# EAGLE design FastFoto (EAGLE 6.5.0)
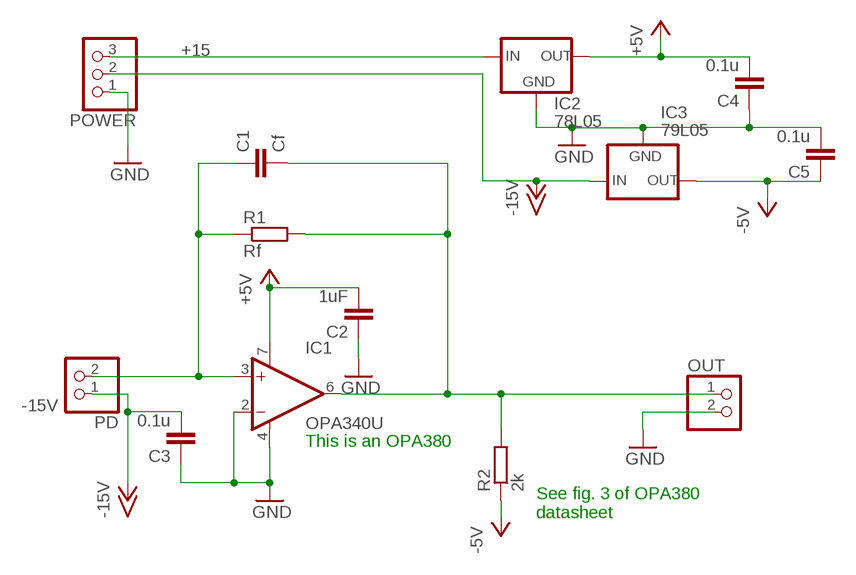
[diagram p0: schematic, sheet 1]

## Parts
C1  Cf  C-EU050-030X075  [C050-030X075]
C2  1uF  C-EU050-030X075  [C050-030X075]
C3  0.1u  C-EU050-030X075  [C050-030X075]
C4  0.1u  C-EU050-030X075  [C050-030X075]
C5  0.1u  C-EU050-030X075  [C050-030X075]
IC1  OPA340U  [SO08]
IC2  78L05  78LXX  [78LXX]
IC3  79L05  79LXX  [79LXX]
OUT  PINHD-1X2  [1X02]
PD  PINHD-1X2  [1X02]
POWER  PINHD-1X3  [1X03]
R1  Rf  R-EU_0204/7  [0204/7]
R2  2k  R-EU_0204/7  [0204/7]

## Nets
+5V: C2.2 C4.2 IC1.7(V+) IC2.OUT
+15: IC2.IN POWER.3
-5V: C5.1 IC3.OUT R2.1
-15V: C3.2 IC3.IN PD.1 POWER.2
GND: C2.1 C3.1 C4.1 C5.2 IC1.2(-IN) IC1.4(V-) IC2.GND IC3.GND OUT.2 POWER.1
N$1: C1.2 IC1.6(OUT) OUT.1 R1.2 R2.2
N$2: C1.1 IC1.3(+IN) PD.2 R1.1

## Notes on the sheet
- This is an OPA380
- See fig. 3 of OPA380
  datasheet

## Library data of the parts
C1-C5 = rcl:C-EU: CAPACITOR, European symbol
IC1 = burr-brown:OPA340: Rail-to-Rail Operational Amplifiers Single-Supply, MicroAmplifier(TM) Series; MPN: OPA340UA; OC_FARNELL: 1106196; OC_NEWARK: 24M5449
IC2 = v-reg:78LXX: VOLTAGE REGULATOR
IC3 = v-reg:79LXX: VOLTAGE REGULATOR
OUT PD = pinhead:PINHD-1X2: PIN HEADER
POWER = pinhead:PINHD-1X3: PIN HEADER
R1 R2 = rcl:R-EU_: RESISTOR, European symbol

## Board
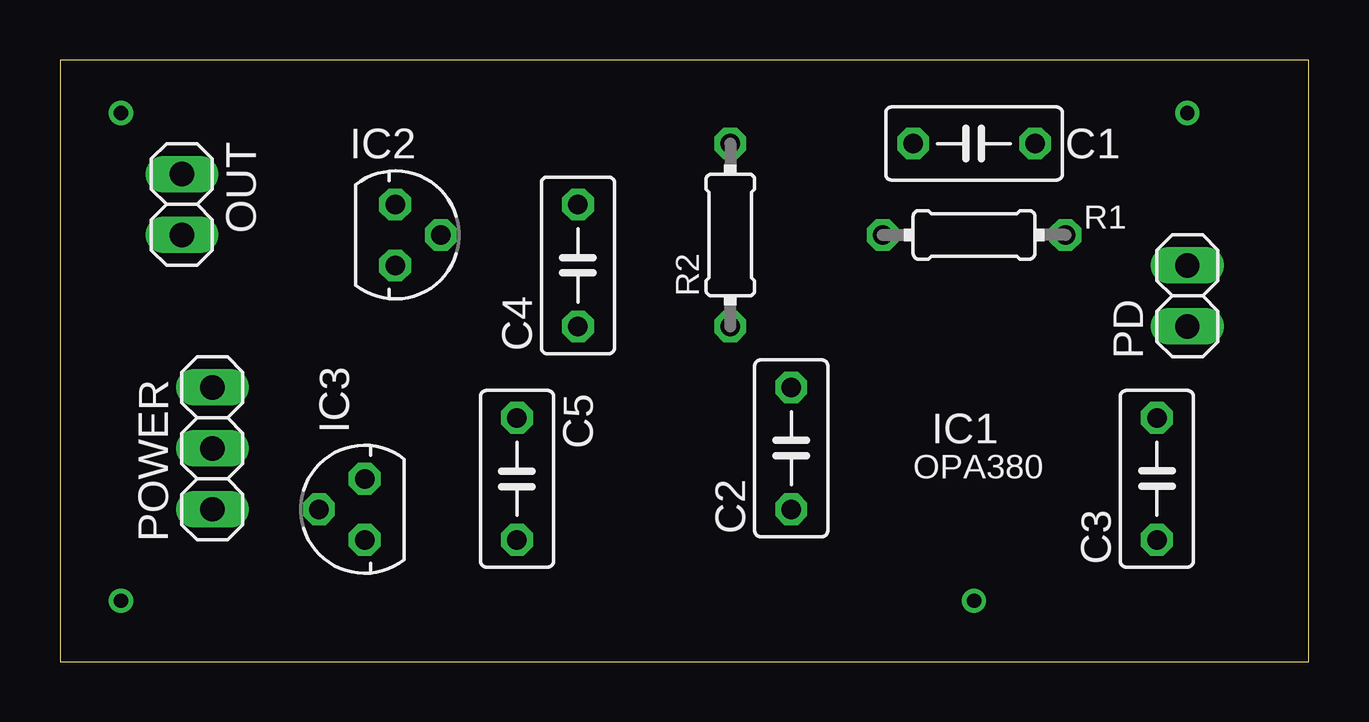
[diagram p1: board, top side]
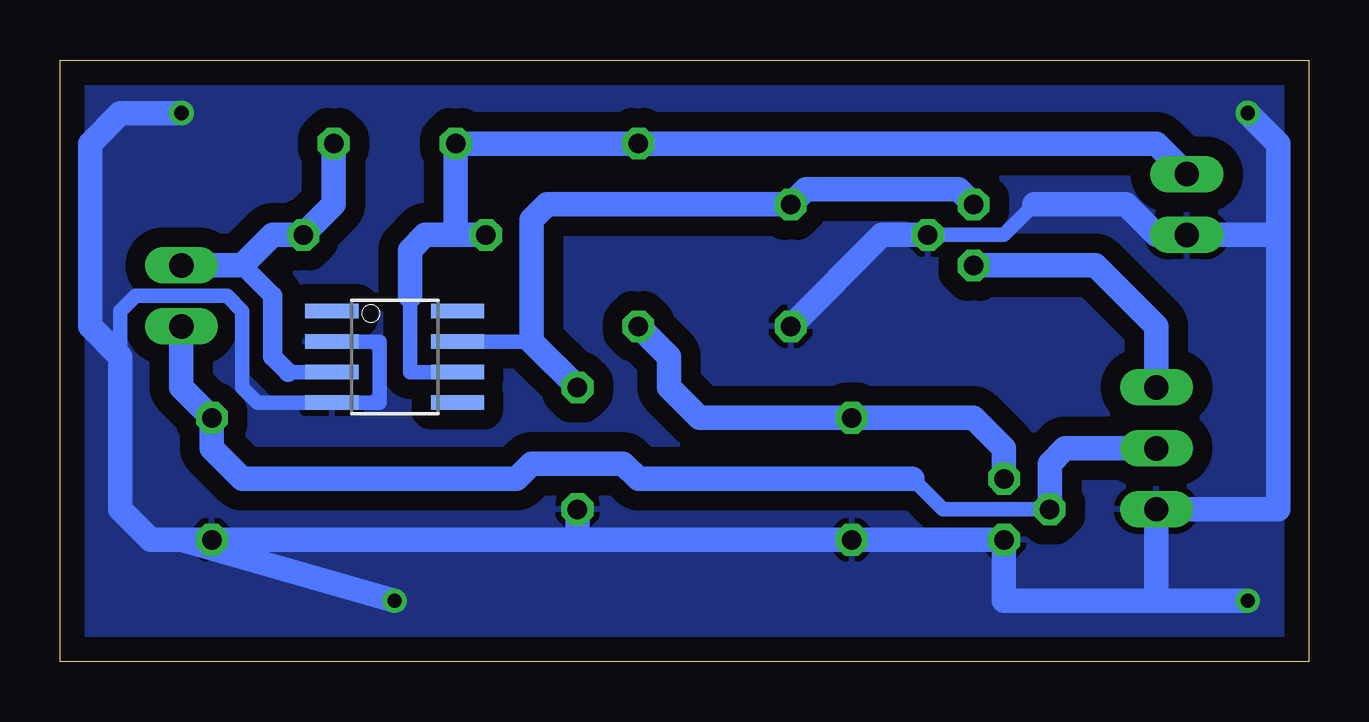
[diagram p2: board, bottom side, seen from below]

Size 52.05 x 25.07 mm. Coordinates in mm from the lower left corner, seen from the top.
Outline: 0,0 52.05,0 52.05,25.07 0,25.07 0,0
Copper layers (1*16): Top 0.035mm / dielectric 1.5mm / Bottom 0.035mm
Design rules "default": minimum track width 10mil, minimum drill 24mil, track to track 8mil, track to pad 8mil, pad to pad 8mil, via to via 8mil, smd to smd 8mil, copper to edge 40mil, drill to drill 8mil, minimum pad ring 10mil, minimum via ring 8mil, stop-mask expansion 4mil, vias tented up to drill 0mil, thermal gap 10mil

### Footprints (pad centres in the part's own frame; a part is rotated, then mirrored left to right if it is on the bottom)
C050-030X075 = drill 0.813 octagon: 1 -2.54,0; 2 2.54,0
SO08 = smd 0.61 x 2.21: 1 -1.905,-2.616; 2 -0.635,-2.616; 3 0.635,-2.616; 4 1.905,-2.616; 5 1.905,2.616; 6 0.635,2.616; 7 -0.635,2.616; 8 -1.905,2.616
78LXX = drill 0.813 octagon: GND 0,1.905; IN 1.27,0; OUT -1.27,0
79LXX = drill 0.813 octagon: GND -1.27,0; IN 0,1.905; OUT 1.27,0
1X02 = drill 1.016 long: 1 -1.27,0; 2 1.27,0
1X03 = drill 1.016 long: 1 -2.54,0; 2 0,0; 3 2.54,0
0204/7 = drill 0.813 octagon: 1 -3.81,0; 2 3.81,0

### Placement (x,y rotation side)
C1  38.1,21.59 180 top
C2  30.48,8.89 90 top
C3  45.72,7.62 90 top
C4  21.59,16.51 90 top
C5  19.05,7.62 270 top
IC1  38.1,12.7 270 bottom
IC2  13.97,17.78 270 top
IC3  12.7,6.35 90 top
OUT  5.08,19.05 270 top
PD  46.99,15.24 90 top
POWER  6.35,8.89 90 top
R1  38.1,17.78 180 top
R2  27.94,17.78 90 top

### Tracks (layer width: path | path; a pad name or v marks a point on that pad's centre or on a via)
+5V
  Bottom 0.61: IC1.7 32.38,13.34
  Bottom 1.016: C2.2 32.38,13.34 32.38,18.41 31.75,19.05 C4.2 20.95,19.68 14.61,19.68 IC2.OUT
+15
  Bottom 1.016: POWER.3 6.35,13.97 8.89,16.51 IC2.IN
-5V
  Bottom 1.016: IC3.OUT 12.7,8.89 13.97,10.16 C5.1 25.4,10.16 26.67,11.43 26.67,12.7 R2.1
-15V
  Bottom 0.61: 16.51,7.62 15.24,6.35 IC3.IN
  Bottom 1.016: IC3.IN 10.79,8.26 10.16,8.89 POWER.2 | PD.1 46.99,11.43 C3.2 45.72,8.89 44.45,7.62 33.02,7.62 32.38,8.26 28.57,8.26 27.94,7.62 16.51,7.62
GND  (via drill 0.6)
  Bottom 0.61: 11.43,19.05 12.7,17.78 IC2.GND | IC1.2 38.73,13.34 38.73,10.79 IC1.4 43.81,10.79 44.45,11.43 44.45,14.61 45.09,15.24 48.9,15.24 49.53,14.61 49.53,12.7
  Bottom 1.016: 6.35,2.54 12.7,2.54 IC3.GND C5.2 30.48,5.08 | 6.35,2.54 POWER.1 1.27,6.35 1.27,17.78 | 30.48,5.08 C2.1 | 30.48,5.08 C3.1 46.99,5.08 | 1.27,17.78 OUT.2 6.35,17.78 7.62,19.05 11.43,19.05 | C4.1 17.78,17.78 IC2.GND | 46.99,5.08 48.26,5.08 49.53,6.35 49.53,12.7 50.8,13.97 50.8,21.59 49.53,22.86 v46.99,22.86 | 1.27,17.78 1.27,21.59 v2.54,22.86 | 6.35,2.54 v2.54,2.54 | v38.1,2.54 46.99,5.08
  pour Bottom (isolate 0.813): 0,0 0,25.4 52.07,25.4 52.07,0
N$1
  Bottom 0.61: IC1.6 37.47,12.06 37.47,15.24
  Bottom 1.016: OUT.1 6.35,21.59 R2.2 C1.2 35.56,17.78 | 37.47,15.24 37.47,17.14 36.83,17.78 35.56,17.78 | 35.56,17.78 R1.2
N$2
  Bottom 0.61: 42.55,12.06 IC1.3
  Bottom 0.813: 44.45,16.51 43.18,15.24 43.18,12.7 42.55,12.06
  Bottom 1.016: C1.1 40.64,19.05 R1.1 43.18,17.78 44.45,16.51 PD.2

### Text on the board
tNames: OPA380
tValues: +15V | -15V | -5V | -15V